# Altium project scc1002.PrjPCB
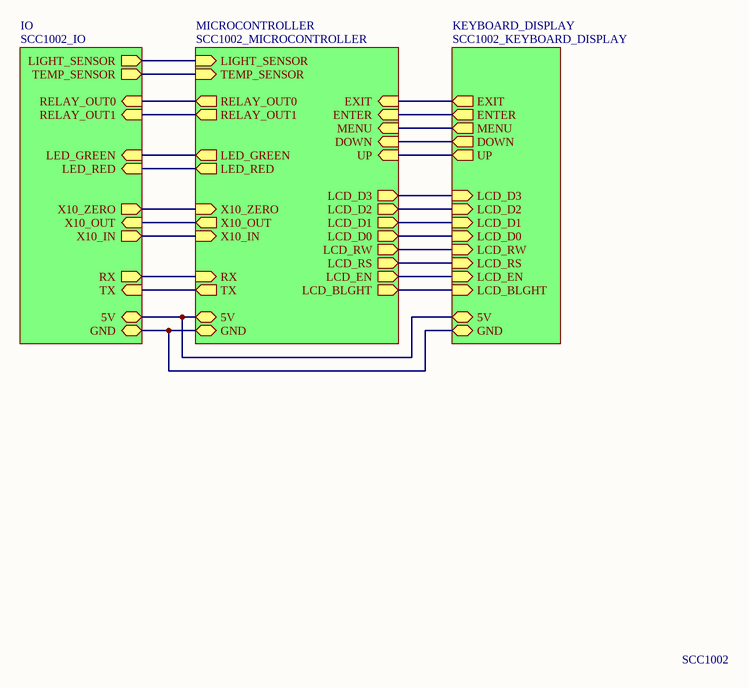
[diagram p0: scc1002_main.SchDoc]
4 sheets, 52 parts. Net scope: hierarchical (ports join the sheet entries above them; power ports are global).
Sheets:
  scc1002_main.SchDoc
    MICROCONTROLLER = SCC1002_MICROCONTROLLER.SchDoc
    KEYBOARD_DISPLAY = SCC1002_KEYBOARD_DISPLAY.SchDoc
    IO = SCC1002_IO.SchDoc

## Sheet scc1002_main.SchDoc
size A4; DrawnBy: Marco

### Sub-sheets
IO = SCC1002_IO: LIGHT_SENSOR (out), TEMP_SENSOR (out), RELAY_OUT0 (in), RELAY_OUT1 (in), LED_GREEN (in), LED_RED (in), X10_ZERO (out), X10_OUT (in), X10_IN (out), RX (out), TX (in), GND, 5V
KEYBOARD_DISPLAY = SCC1002_KEYBOARD_DISPLAY: EXIT (out), ENTER (out), MENU (out), DOWN (out), UP (out), LCD_D3 (in), LCD_D2 (in), LCD_D1 (in), LCD_D0 (in), LCD_RW (in), LCD_RS (in), LCD_EN (in), GND, 5V, LCD_BLGHT (in)
MICROCONTROLLER = SCC1002_MICROCONTROLLER: EXIT (in), ENTER (in), MENU (in), DOWN (in), UP (in), LCD_D3 (out), LCD_D2 (out), LCD_D1 (out), LCD_D0 (out), LCD_RW (out), LCD_RS (out), LCD_EN (out), LIGHT_SENSOR (in), TEMP_SENSOR (in), RELAY_OUT0 (out), RELAY_OUT1 (out), LED_GREEN (out), LED_RED (out), X10_ZERO (in), X10_OUT (out), X10_IN (in), RX (in), TX (out), GND, 5V, LCD_BLGHT (out)

### Nets
GND: sheet MICROCONTROLLER/GND, sheet KEYBOARD_DISPLAY/GND, sheet IO/GND
VCC: sheet MICROCONTROLLER/5V, sheet KEYBOARD_DISPLAY/5V, sheet IO/5V
NetC?#4_1: sheet MICROCONTROLLER/UP, sheet KEYBOARD_DISPLAY/UP
NetC?#5_1: sheet MICROCONTROLLER/MENU, sheet KEYBOARD_DISPLAY/MENU
NetC?#6_1: sheet MICROCONTROLLER/ENTER, sheet KEYBOARD_DISPLAY/ENTER
NetC?#7_1: sheet MICROCONTROLLER/EXIT, sheet KEYBOARD_DISPLAY/EXIT
NetC?#8_1: sheet MICROCONTROLLER/DOWN, sheet KEYBOARD_DISPLAY/DOWN
NetLDR_1: sheet MICROCONTROLLER/LIGHT_SENSOR, sheet IO/LIGHT_SENSOR
NetP?#1_4: sheet MICROCONTROLLER/LCD_RS, sheet KEYBOARD_DISPLAY/LCD_RS
NetP?#1_5: sheet MICROCONTROLLER/LCD_RW, sheet KEYBOARD_DISPLAY/LCD_RW
NetP?#1_6: sheet MICROCONTROLLER/LCD_EN, sheet KEYBOARD_DISPLAY/LCD_EN
NetP?#1_11: sheet MICROCONTROLLER/LCD_D0, sheet KEYBOARD_DISPLAY/LCD_D0
NetP?#1_12: sheet MICROCONTROLLER/LCD_D1, sheet KEYBOARD_DISPLAY/LCD_D1
NetP?#1_13: sheet MICROCONTROLLER/LCD_D2, sheet KEYBOARD_DISPLAY/LCD_D2
NetP?#1_14: sheet MICROCONTROLLER/LCD_D3, sheet KEYBOARD_DISPLAY/LCD_D3
NetP?#1_15: sheet MICROCONTROLLER/LCD_BLGHT, sheet KEYBOARD_DISPLAY/LCD_BLGHT
NetP?#4_1: sheet MICROCONTROLLER/X10_ZERO, sheet IO/X10_ZERO
NetP?#4_3: sheet MICROCONTROLLER/X10_IN, sheet IO/X10_IN
NetR?#8_1: sheet MICROCONTROLLER/TEMP_SENSOR, sheet IO/TEMP_SENSOR
NetR?#10_2: sheet MICROCONTROLLER/RELAY_OUT1, sheet IO/RELAY_OUT1
NetR?#11_2: sheet MICROCONTROLLER/LED_GREEN, sheet IO/LED_GREEN
NetR?#12_2: sheet MICROCONTROLLER/LED_RED, sheet IO/LED_RED
NetR?#15_2: sheet MICROCONTROLLER/X10_OUT, sheet IO/X10_OUT
NetU?#1_6: sheet MICROCONTROLLER/RELAY_OUT0, sheet IO/RELAY_OUT0
NetU?#1_25: sheet MICROCONTROLLER/TX, sheet IO/TX
NetU?#1_26: sheet MICROCONTROLLER/RX, sheet IO/RX

### Notes on the sheet
- SCC1002

## Sheet SCC1002_MICROCONTROLLER.SchDoc
size A4; DrawnBy: Marco; Organization: HomeAuto; ProjectName: SCC1002
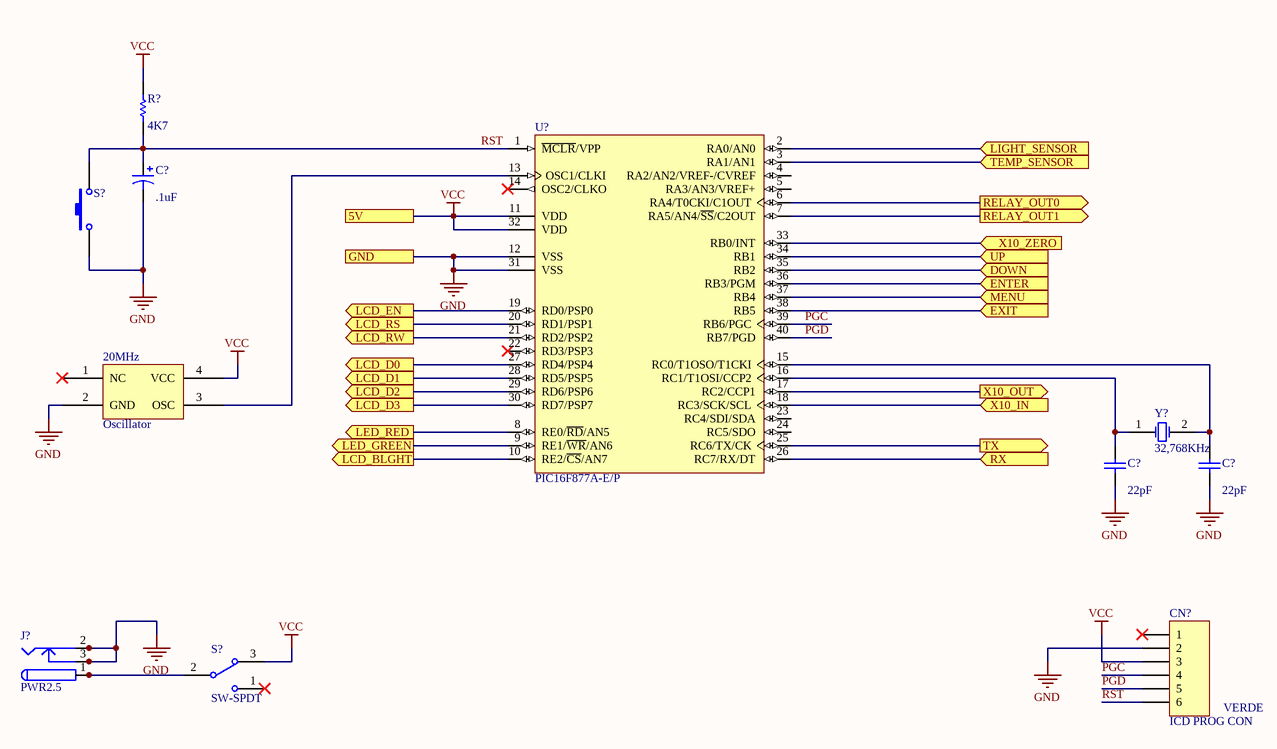
[diagram p1: SCC1002_MICROCONTROLLER.SchDoc]

### Parts
(Parts that share a designator on the sheet are numbered #1, #2 ... from top to bottom, then left to right.)
20MHz  Oscillator
C?#1  value .1uF  [RB7.6-15]  (hidden comment: Cap Pol1)
C?#2  value 22pF  [RAD-0.3]  (hidden comment: Cap)
C?#3  value 22pF  [RAD-0.3]  (hidden comment: Cap)
CN?  ICD PROG CON  [HDR1X6]
J?#1  PWR2.5  [KLD-0202]
R?#1  value 4K7  [AXIAL-0.3]  (hidden comment: Res1)
S?#1  SW-PB  [SPST-2]  (value not drawn)
S?#2  SW-SPDT  [TL36WW15050]
U?#1  PIC16F877A-E/P  [PDIP600-P40]
Y?  32,768KHz  [R38]

### Ports
5V, DOWN (in), ENTER (in), EXIT (in), GND, LCD_BLGHT (out), LCD_D0 (out), LCD_D1 (out), LCD_D2 (out), LCD_D3 (out), LCD_EN (out), LCD_RS (out), LCD_RW (out), LED_GREEN (out), LED_RED (out), LIGHT_SENSOR (in), MENU (in), RELAY_OUT0 (out), RELAY_OUT1 (out), RX (in), TEMP_SENSOR (in), TX (out), UP (in), X10_IN (in), X10_OUT (out), X10_ZERO (in)

### Nets
GND: 20MHz.2(GND) C?#1.2 C?#2.1 C?#3.1 CN?.2 J?#1.2 J?#1.2A J?#1.2B J?#1.3 J?#1.3A J?#1.3B S?#1.1 U?#1.12(VSS) U?#1.31(VSS) ; port GND
VCC: 20MHz.4(VCC) CN?.3 R?#1.2 S?#2.3 U?#1.11(VDD) U?#1.32(VDD) ; port 5V
PGC: CN?.4 U?#1.39(RB6/PGC)
PGD: CN?.5 U?#1.40(RB7/PGD)
RST: C?#1.1 CN?.6 R?#1.1 S?#1.2 U?#1.1(~{MCLR}/VPP)
Net20MHz_3: 20MHz.3(OSC) U?#1.13(OSC1/CLKI)
NetC?#2_2: C?#2.2 U?#1.16(RC1/T1OSI/CCP2) Y?.1(OSC1)
NetC?#3_2: C?#3.2 U?#1.15(RC0/T1OSO/T1CKI) Y?.2(OSC2)
NetC?#4_1: U?#1.34(RB1) ; port UP
NetC?#5_1: U?#1.37(RB4) ; port MENU
NetC?#6_1: U?#1.36(RB3/PGM) ; port ENTER
NetC?#7_1: U?#1.38(RB5) ; port EXIT
NetC?#8_1: U?#1.35(RB2) ; port DOWN
NetJ?#1_1: J?#1.1 J?#1.1A J?#1.1B S?#2.2
NetLDR_1: U?#1.2(RA0/AN0) ; port LIGHT_SENSOR
NetP?#1_4: U?#1.20(RD1/PSP1) ; port LCD_RS
NetP?#1_5: U?#1.21(RD2/PSP2) ; port LCD_RW
NetP?#1_6: U?#1.19(RD0/PSP0) ; port LCD_EN
NetP?#1_11: U?#1.27(RD4/PSP4) ; port LCD_D0
NetP?#1_12: U?#1.28(RD5/PSP5) ; port LCD_D1
NetP?#1_13: U?#1.29(RD6/PSP6) ; port LCD_D2
NetP?#1_14: U?#1.30(RD7/PSP7) ; port LCD_D3
NetP?#1_15: U?#1.10(RE2/~{CS}/AN7) ; port LCD_BLGHT
NetP?#4_1: U?#1.33(RB0/INT) ; port X10_ZERO
NetP?#4_3: U?#1.18(RC3/SCK/SCL) ; port X10_IN
NetR?#8_1: U?#1.3(RA1/AN1) ; port TEMP_SENSOR
NetR?#10_2: U?#1.7(RA5/AN4/~{SS}/C2OUT) ; port RELAY_OUT1
NetR?#11_2: U?#1.9(RE1/~{WR}/AN6) ; port LED_GREEN
NetR?#12_2: U?#1.8(RE0/~{RD}/AN5) ; port LED_RED
NetR?#15_2: U?#1.17(RC2/CCP1) ; port X10_OUT
NetU?#1_6: U?#1.6(RA4/T0CKI/C1OUT) ; port RELAY_OUT0
NetU?#1_25: U?#1.25(RC6/TX/CK) ; port TX
NetU?#1_26: U?#1.26(RC7/RX/DT) ; port RX

Not connected (* = marked no-connect by the designer): 20MHz 1(NC)*; CN? 1*; S?#2 1*; U?#1 4(RA2/AN2/VREF-/CVREF) 5(RA3/AN3/VREF+) 14(OSC2/CLKO)* 22(RD3/PSP3)* 23(RC4/SDI/SDA) 24(RC5/SDO)

### Notes on the sheet
- VERDE

### Library data of the parts
20MHz = Oscilator: Integrated oscillator
C?#1 = Cap Pol1: Polarized Capacitor (Radial); Published: 8-Jun-2000; LatestRevisionDate: 17-Jul-2002; LatestRevisionNote: Re-released for DXP Platform.; PackageReference: RB7.6-15; Publisher: Altium Limited; PackageDescription: Polarized Capacitor (Radial); 2 Leads
C?#2 C?#3 = Cap: Capacitor; Published: 8-Jun-2000; LatestRevisionDate: 17-Jul-2002; LatestRevisionNote: Re-released for DXP Platform.; PackageReference: RAD-0.3; Publisher: Altium Limited; PackageDescription: Radial Cap, Thru-Hole; 2 Leads; 0.3 in Pin Spacing
CN? = Header 6: Header, 6-Pin; LatestRevisionDate: 17-Jul-2002; LatestRevisionNote: Re-released for DXP Platform.; Publisher: Altium Limited
J?#1 = PWR2.5: Low Voltage Power Supply Connector; Published: 17-Dec-2003; DatasheetDocument: 09-May-2002; Publisher: Altium Limited; ComponentLink1Description: Manufacturer Link; ComponentLink1URL: http://domino.kycon.com/internet/Products.html
R?#1 = Res1: Resistor; Published: 8-Jun-2000; LatestRevisionDate: 17-Jul-2002; LatestRevisionNote: Re-released for DXP Platform.; PackageReference: AXIAL-0.3; Publisher: Altium Limited; PackageDescription: Axial Device, Thru-Hole; 2 Leads; 0.3 in Pin Spacing
S?#1 = SW-PB: Switch; Published: 24-Mar-1999; LatestRevisionDate: 17-Jul-2002; LatestRevisionNote: Re-released for DXP Platform.; PackageReference: SPST-2; Publisher: Altium Limited; PackageDescription: Switch; 2 Leads
S?#2 = SW-SPDT: SPDT Subminiature Toggle Switch, Right Angle Mounting, Vertical Actuation; Published: 24-Mar-1999; LatestRevisionDate: 17-Dec-2003; LatestRevisionNote: Schematic revised, PCB Footprint replaced.; DatasheetVersion: 05-Dec-2000; PackageReference: TL36WW15050; Publisher: Altium Limited; PackageDescription: Switch; 4 Leads; ComponentLink1Description: Manufacturer Link; ComponentLink1URL: http://www.apem.com
U?#1 = PIC16F877A-E/P: Enhanced FLASH Microcontroller, 8K (x14-Bit words) FLASH, 368 Bytes RAM, 40-Pin PDIP, Standard VDD Range, Extended Temperature; ComponentAvailability: Unknown. Contact manufacturer to determine status.; Published: 11-Oct-2004; LatestRevisionDate: 29-Jan-2009; LatestRevisionNote: Sch. layout revised. 3D Model Removed.; DatasheetVersion: revB, Oct-2003; PackageVersion: revBB, Aug-2009; PackageReference: PDIP600-P40; Publisher: Altium Limited; PackageDescription: 40-Lead Plastic Dual In-Line (P) - 600 mil Body [PDIP]; Supplier 1: Digi-Key; Supplier Part Number 1: PIC16F877A-E/P-ND; Supplier 2: Farnell; Supplier Part Number 2: 1567990; ComponentLink1Description: Datasheet; ComponentLink1URL: http://ww1.microchip.com/downloads/en/DeviceDoc/39582b.pdf; ComponentLink2Description: Packaging Specification; ComponentLink2URL: http://www.microchip.com/stellent/groups/techpub_sg/documents/packagingspec/en012702.pdf; ComponentLink3Description: Microchip.com Home; ComponentLink3URL: http://www.microchip.com/
Y? = XTAL: Crystal Oscillator; Published: 8-Jun-2000; LatestRevisionDate: 17-Jul-2002; LatestRevisionNote: Re-released for DXP Platform.; PackageReference: R38; Publisher: Altium Limited; PackageDescription: Crystal, Thru-Hole; 2 Leads; Body 3.1 x 8.2 mm (Dia.xH)

## Sheet SCC1002_KEYBOARD_DISPLAY.SchDoc
size A4; DrawnBy: Marco
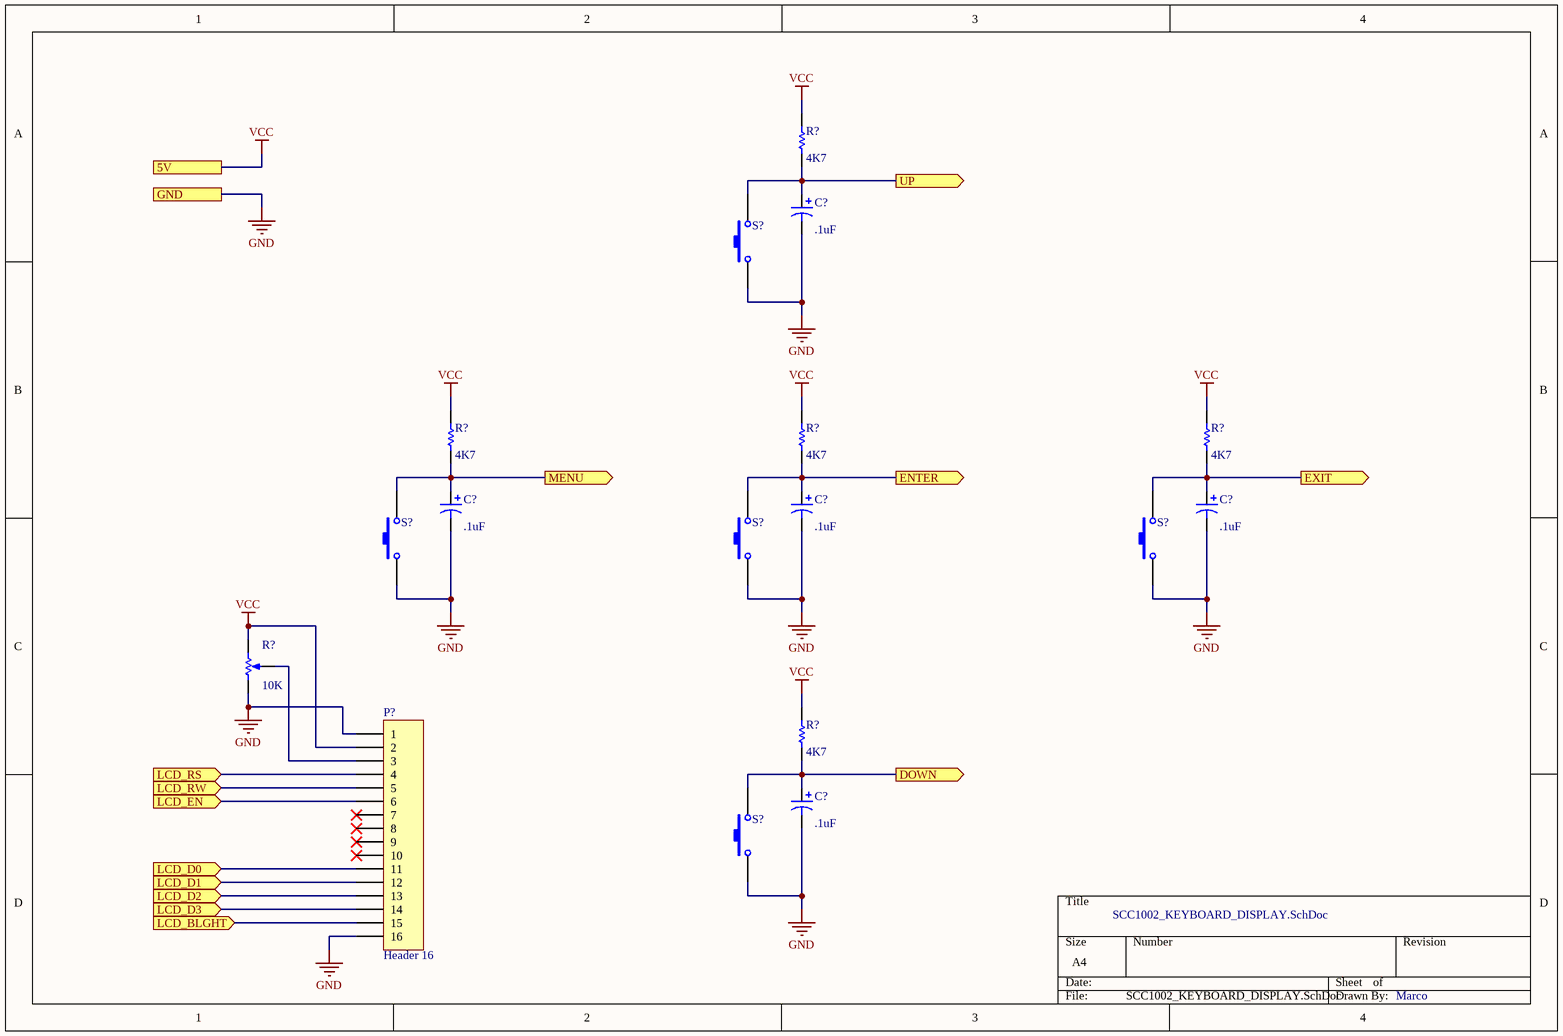
[diagram p2: SCC1002_KEYBOARD_DISPLAY.SchDoc]

### Parts
(Parts that share a designator on the sheet are numbered #1, #2 ... from top to bottom, then left to right.)
C?#4  value .1uF  [RB7.6-15]  (hidden comment: Cap Pol1)
C?#5  value .1uF  [RB7.6-15]  (hidden comment: Cap Pol1)
C?#6  value .1uF  [RB7.6-15]  (hidden comment: Cap Pol1)
C?#7  value .1uF  [RB7.6-15]  (hidden comment: Cap Pol1)
C?#8  value .1uF  [RB7.6-15]  (hidden comment: Cap Pol1)
P?#1  Header 16  [HDR1X16]
R?#2  value 4K7  [AXIAL-0.3]  (hidden comment: Res1)
R?#3  value 4K7  [AXIAL-0.3]  (hidden comment: Res1)
R?#4  value 4K7  [AXIAL-0.3]  (hidden comment: Res1)
R?#5  value 4K7  [AXIAL-0.3]  (hidden comment: Res1)
R?#6  value 10K  [VR5]  (hidden comment: RPot)
R?#7  value 4K7  [AXIAL-0.3]  (hidden comment: Res1)
S?#3  SW-PB  [SPST-2]  (value not drawn)
S?#4  SW-PB  [SPST-2]  (value not drawn)
S?#5  SW-PB  [SPST-2]  (value not drawn)
S?#6  SW-PB  [SPST-2]  (value not drawn)
S?#7  SW-PB  [SPST-2]  (value not drawn)

### Ports
5V, DOWN (out), ENTER (out), EXIT (out), GND, LCD_BLGHT (in), LCD_D0 (in), LCD_D1 (in), LCD_D2 (in), LCD_D3 (in), LCD_EN (in), LCD_RS (in), LCD_RW (in), MENU (out), UP (out)

### Nets
GND: C?#4.2 C?#5.2 C?#6.2 C?#7.2 C?#8.2 P?#1.1 P?#1.16 R?#6.1(TOP) S?#3.1 S?#4.1 S?#5.1 S?#6.1 S?#7.1 ; port GND
VCC: P?#1.2 R?#2.2 R?#3.2 R?#4.2 R?#5.2 R?#6.2(BOT) R?#7.2 ; port 5V
NetC?#4_1: C?#4.1 R?#2.1 S?#3.2 ; port UP
NetC?#5_1: C?#5.1 R?#3.1 S?#4.2 ; port MENU
NetC?#6_1: C?#6.1 R?#4.1 S?#5.2 ; port ENTER
NetC?#7_1: C?#7.1 R?#5.1 S?#6.2 ; port EXIT
NetC?#8_1: C?#8.1 R?#7.1 S?#7.2 ; port DOWN
NetP?#1_3: P?#1.3 R?#6.3(TAP)
NetP?#1_4: P?#1.4 ; port LCD_RS
NetP?#1_5: P?#1.5 ; port LCD_RW
NetP?#1_6: P?#1.6 ; port LCD_EN
NetP?#1_11: P?#1.11 ; port LCD_D0
NetP?#1_12: P?#1.12 ; port LCD_D1
NetP?#1_13: P?#1.13 ; port LCD_D2
NetP?#1_14: P?#1.14 ; port LCD_D3
NetP?#1_15: P?#1.15 ; port LCD_BLGHT

Not connected (* = marked no-connect by the designer): P?#1 7* 8* 9* 10*

### Library data of the parts
C?#4-C?#8 = Cap Pol1: Polarized Capacitor (Radial); Published: 8-Jun-2000; LatestRevisionDate: 17-Jul-2002; LatestRevisionNote: Re-released for DXP Platform.; PackageReference: RB7.6-15; Publisher: Altium Limited; PackageDescription: Polarized Capacitor (Radial); 2 Leads
P?#1 = Header 16: Header, 16-Pin; LatestRevisionDate: 17-Jul-2002; LatestRevisionNote: Re-released for DXP Platform.; Publisher: Altium Limited
R?#2-R?#5 R?#7 = Res1: Resistor; Published: 8-Jun-2000; LatestRevisionDate: 17-Jul-2002; LatestRevisionNote: Re-released for DXP Platform.; PackageReference: AXIAL-0.3; Publisher: Altium Limited; PackageDescription: Axial Device, Thru-Hole; 2 Leads; 0.3 in Pin Spacing
R?#6 = RPot: Potentiometer; Sim Note: Enter the Resistance value and the set point into parameter fields.; Set Position: 0.5; Published: 8-Jun-2000; LatestRevisionDate: 17-Jul-2002; LatestRevisionNote: Re-released for DXP Platform.; PackageReference: VR5; Publisher: Altium Limited; PackageDescription: Variable Resistor, Thru-Hole; 3 Leads
S?#3-S?#7 = SW-PB: Switch; Published: 24-Mar-1999; LatestRevisionDate: 17-Jul-2002; LatestRevisionNote: Re-released for DXP Platform.; PackageReference: SPST-2; Publisher: Altium Limited; PackageDescription: Switch; 2 Leads

## Sheet SCC1002_IO.SchDoc
size A4; DrawnBy: Marco
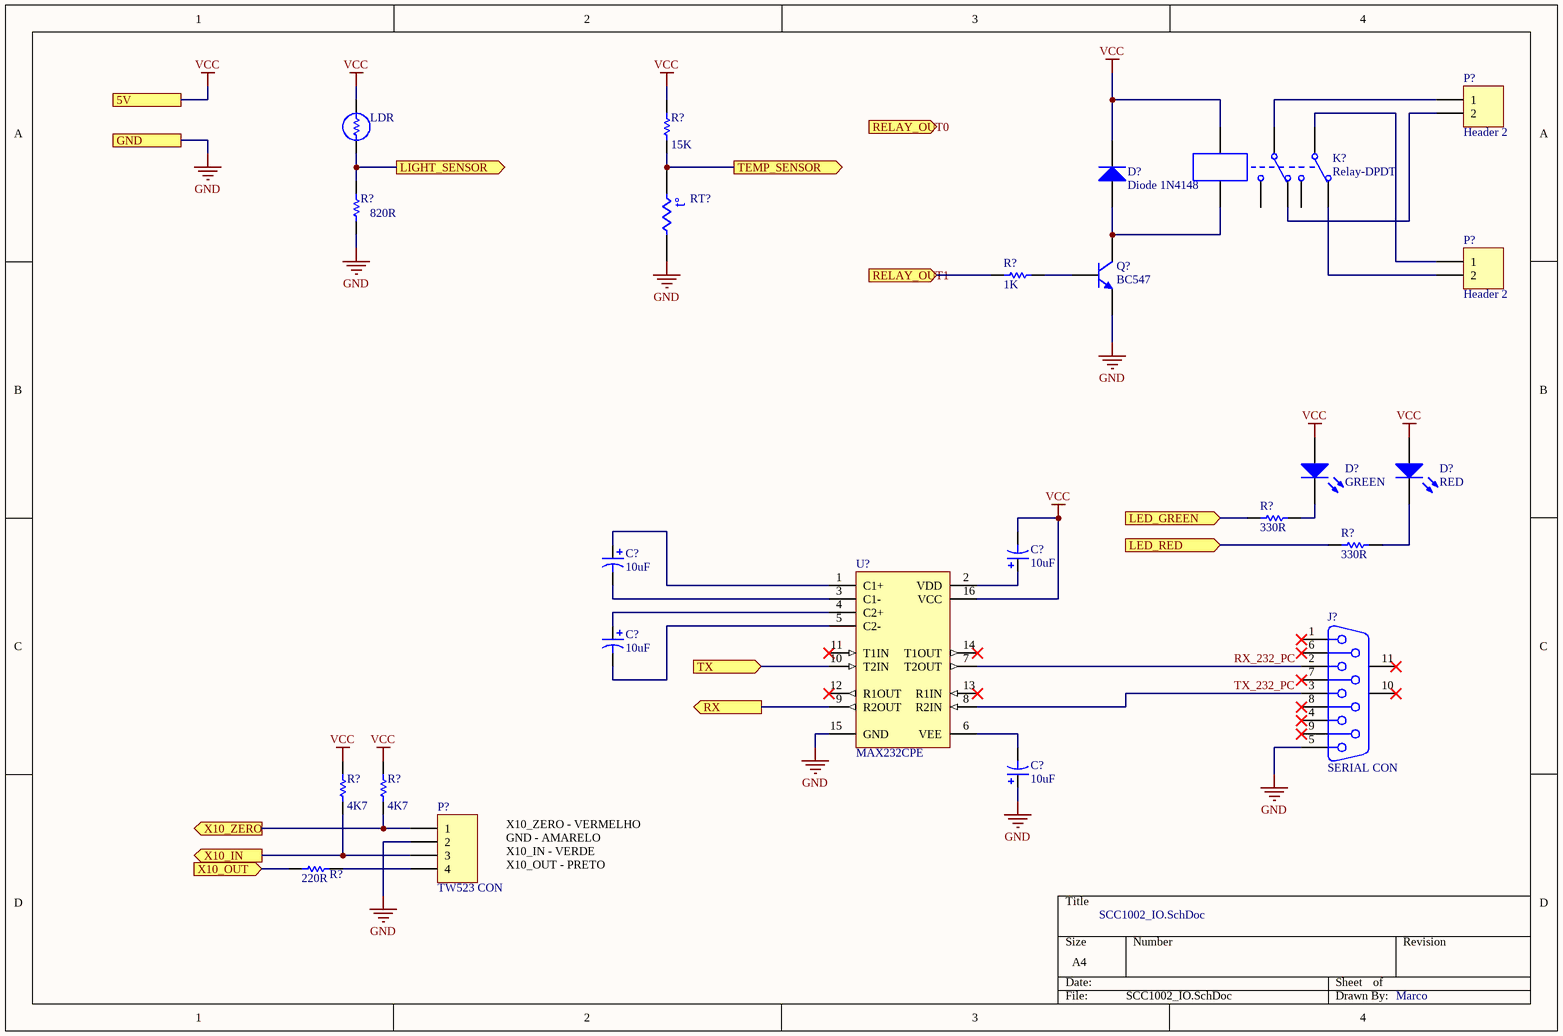
[diagram p3: SCC1002_IO.SchDoc]

### Parts
(Parts that share a designator on the sheet are numbered #1, #2 ... from top to bottom, then left to right.)
C?#9  value 10uF  [RB7.6-15]  (hidden comment: Cap Pol1)
C?#10  value 10uF  [RB7.6-15]  (hidden comment: Cap Pol1)
C?#11  value 10uF  [RB7.6-15]  (hidden comment: Cap Pol1)
C?#12  value 10uF  [RB7.6-15]  (hidden comment: Cap Pol1)
D?#1  Diode 1N4148  [DO-35]
D?#2  GREEN  [3.2X1.6X1.1]
D?#3  RED  [3.2X1.6X1.1]
J?#2  SERIAL CON  [DSUB1.385-2H9]
K?  Relay-DPDT  [DIP-P8]
LDR  LDR  (value not drawn)
P?#2  Header 2  [HDR1X2]
P?#3  Header 2  [HDR1X2]
P?#4  TW523 CON  [HDR1X4]
Q?  BC547  [TO-92A]
R?#8  value 15K  [AXIAL-0.3]  (hidden comment: Res1)
R?#9  value 820R  [AXIAL-0.3]  (hidden comment: Res1)
R?#10  value 1K  [AXIAL-0.3]  (hidden comment: Res1)
R?#11  value 330R  [AXIAL-0.3]  (hidden comment: Res1)
R?#12  value 330R  [AXIAL-0.3]  (hidden comment: Res1)
R?#13  value 4K7  [AXIAL-0.3]  (hidden comment: Res1)
R?#14  value 4K7  [AXIAL-0.3]  (hidden comment: Res1)
R?#15  value 220R  [AXIAL-0.3]  (hidden comment: Res1)
RT?  Res Thermal  [6-0805_N]  (value not drawn)
U?#2  MAX232CPE  [PE16A]

### Ports
5V, GND, LED_GREEN (in), LED_RED (in), LIGHT_SENSOR (out), RELAY_OUT0 (in), RELAY_OUT1 (in), RX (out), TEMP_SENSOR (out), TX (in), X10_IN (out), X10_OUT (in), X10_ZERO (out)

### Nets
GND: C?#12.1 J?#2.5 P?#4.2 Q?.1(E) R?#9.1 RT?.2 U?#2.15(GND) ; port GND
VCC: C?#10.2 D?#1.2(K) D?#2.1(A) D?#3.1(A) K?.7 LDR.2 R?#8.2 R?#13.2 R?#14.2 U?#2.16(VCC) ; port 5V
RX_232_PC: J?#2.2 U?#2.7(T2OUT)
TX_232_PC: J?#2.3 U?#2.8(R2IN)
NetC?#9_1: C?#9.1 U?#2.1(C1+)
NetC?#9_2: C?#9.2 U?#2.3(C1-)
NetC?#10_1: C?#10.1 U?#2.2(VDD)
NetC?#11_1: C?#11.1 U?#2.4(C2+)
NetC?#11_2: C?#11.2 U?#2.5(C2-)
NetC?#12_2: C?#12.2 U?#2.6(VEE)
NetD?#1_1: D?#1.1(A) K?.8 Q?.3(C)
NetD?#2_2: D?#2.2(K) R?#11.1
NetD?#3_2: D?#3.2(K) R?#12.1
NetK?_1: K?.1 P?#3.1
NetK?_2: K?.2 P?#3.2
NetK?_4: K?.4 P?#2.1
NetK?_5: K?.5 P?#2.2
NetLDR_1: LDR.1 R?#9.2 ; port LIGHT_SENSOR
NetP?#4_1: P?#4.1 R?#14.1 ; port X10_ZERO
NetP?#4_3: P?#4.3 R?#13.1 ; port X10_IN
NetP?#4_4: P?#4.4 R?#15.1
NetQ?_2: Q?.2(B) R?#10.1
NetR?#8_1: R?#8.1 RT?.1 ; port TEMP_SENSOR
NetR?#10_2: R?#10.2 ; port RELAY_OUT1
NetR?#11_2: R?#11.2 ; port LED_GREEN
NetR?#12_2: R?#12.2 ; port LED_RED
NetR?#15_2: R?#15.2 ; port X10_OUT
NetU?#1_25: U?#2.10(T2IN) ; port TX
NetU?#1_26: U?#2.9(R2OUT) ; port RX

Not connected (* = marked no-connect by the designer): J?#2 1* 4* 6* 7* 8* 9* 10(MH1)* 11(MH2)*; K? 3 6; U?#2 11(T1IN)* 12(R1OUT)* 13(R1IN)* 14(T1OUT)*

### Notes on the sheet
- X10_ZERO - VERMELHO
  GND - AMARELO
  X10_IN - VERDE
  X10_OUT - PRETO
- (in symbol Res Thermal) t°

### Library data of the parts
C?#9-C?#12 = Cap Pol1: Polarized Capacitor (Radial); Published: 8-Jun-2000; LatestRevisionDate: 17-Jul-2002; LatestRevisionNote: Re-released for DXP Platform.; PackageReference: RB7.6-15; Publisher: Altium Limited; PackageDescription: Polarized Capacitor (Radial); 2 Leads
D?#1 = Diode 1N4148: High Conductance Fast Diode; Published: 8-Jun-2000; LatestRevisionDate: 17-Jul-2002; LatestRevisionNote: Re-released for DXP Platform.; DatasheetVersion: 1997; PackageReference: DO-35; Publisher: Altium Limited; PackageDescription: Diode, Axial; Body 3.8 x 1.9 mm (LxDia. max), Lead Dia. 0.53 mm (max); Code_JEDEC: DO-204-AH; ComponentLink1Description: Manufacturer Link; ComponentLink1URL: http://www.fairchildsemi.com/; ComponentLink2Description: Datasheet; ComponentLink2URL: http://www.fairchildsemi.com/ds/1N%2F1N4148.pdf
D?#2 D?#3 = LED2: Typical RED, GREEN, YELLOW, AMBER GaAs LED; Published: 8-Jun-2000; LatestRevisionDate: 17-Jul-2002; LatestRevisionNote: Re-released for DXP Platform.; PackageVersion: Feb-2002; PackageReference: 3.2X1.6X1.1; Publisher: Altium Limited; PackageDescription: SM LED; 2 Flat Leads
J?#2 = D Connector 9: Receptacle Assembly, 9 Position, Right Angle; PackageDocument: O; Positions: 9; Published: 15-Jun-2001; LatestRevisionDate: 17-Jul-2002; LatestRevisionNote: Re-released for DXP Platform.; DatasheetDocument: 1-Sep-1999; PackageReference: 788750; Publisher: Altium Limited; Orientation: Right Angle; Gender: Receptacle
K? = Relay-DPDT: Dual-Pole Dual-Throw Relay; Published: 24-Mar-1999; LatestRevisionDate: 17-Jul-2002; LatestRevisionNote: Re-released for DXP Platform.; PackageReference: DIP-P8; Publisher: Altium Limited; PackageDescription: Relay; 8 Leads
LDR = LDR: Light Dependent Resistor
P?#2 P?#3 = Header 2: Header, 2-Pin; LatestRevisionDate: 17-Jul-2002; LatestRevisionNote: Re-released for DXP Platform.; Publisher: Altium Limited
P?#4 = Header 4: Header, 4-Pin; LatestRevisionDate: 17-Jul-2002; LatestRevisionNote: Re-released for DXP Platform.; Publisher: Altium Limited
Q? = 2N3904: NPN General Purpose Amplifier; Published: 8-Jun-2000; LatestRevisionDate: 15-Jan-2003; LatestRevisionNote: PCB Footprint 'BCY-W3/D4.7' replaced; DatasheetVersion: 1997; PackageVersion: Sep-1998; PackageReference: TO-92A; Publisher: Altium Limited; PackageDescription: TO, Flat Index; 3 In-Line, Axial Leads; Body Dia. 4.5mm; Leads 0.51 x 0.48 mm (max); ComponentLink1Description: Manufacturer Link; ComponentLink1URL: http://www.fairchildsemi.com/; ComponentLink2Description: Datasheet; ComponentLink2URL: http://www.fairchildsemi.com/ds/2N%2F2N3904.pdf
R?#8-R?#15 = Res1: Resistor; Published: 8-Jun-2000; LatestRevisionDate: 17-Jul-2002; LatestRevisionNote: Re-released for DXP Platform.; PackageReference: AXIAL-0.3; Publisher: Altium Limited; PackageDescription: Axial Device, Thru-Hole; 2 Leads; 0.3 in Pin Spacing
RT? = Res Thermal: Thermistor; Published: 24-Mar-1999; LatestRevisionDate: 29-May-2009; LatestRevisionNote: IPC-7351 Footprint Added.; PackageVersion: Mar-2003; PackageReference: 6-0805; Publisher: Altium Limited; PackageDescription: Chip Resistor 0805 Case Size; Code_IPC: RESC2012
U?#2 = MAX232CPE: +5V Powered RS-232 Driver/Receiver; Published: 16-Jan-2001; LatestRevisionDate: 29-May-2009; LatestRevisionNote: Component Body Added.; DatasheetVersion: Apr-1992; PackageVersion: 1997; PackageReference: PE16A; Publisher: Altium Limited; PackageDescription: DIP, 16-Pin, Row Spacing 7.62 mm, Pitch 2.54 mm; Code_JEDEC: MS-001-BB; ComponentLink1Description: Manufacturer Link; ComponentLink1URL: http://www.maxim-ic.com/; ComponentLink2Description: Datasheet; ComponentLink2URL: http://pdfserv.maxim-ic.com/en/ds/MAX220-MAX249.pdf

## Nets that join several sheets
GND: SCC1002_MICROCONTROLLER (14 pins), SCC1002_KEYBOARD_DISPLAY (13 pins), SCC1002_IO (7 pins)
VCC: SCC1002_MICROCONTROLLER (6 pins), SCC1002_KEYBOARD_DISPLAY (7 pins), SCC1002_IO (10 pins)
NetC?#4_1: SCC1002_MICROCONTROLLER (U?#1.34), SCC1002_KEYBOARD_DISPLAY (C?#4.1 R?#2.1 S?#3.2)
NetC?#5_1: SCC1002_MICROCONTROLLER (U?#1.37), SCC1002_KEYBOARD_DISPLAY (C?#5.1 R?#3.1 S?#4.2)
NetC?#6_1: SCC1002_MICROCONTROLLER (U?#1.36), SCC1002_KEYBOARD_DISPLAY (C?#6.1 R?#4.1 S?#5.2)
NetC?#7_1: SCC1002_MICROCONTROLLER (U?#1.38), SCC1002_KEYBOARD_DISPLAY (C?#7.1 R?#5.1 S?#6.2)
NetC?#8_1: SCC1002_MICROCONTROLLER (U?#1.35), SCC1002_KEYBOARD_DISPLAY (C?#8.1 R?#7.1 S?#7.2)
NetLDR_1: SCC1002_MICROCONTROLLER (U?#1.2), SCC1002_IO (LDR.1 R?#9.2)
NetP?#1_4: SCC1002_MICROCONTROLLER (U?#1.20), SCC1002_KEYBOARD_DISPLAY (P?#1.4)
NetP?#1_5: SCC1002_MICROCONTROLLER (U?#1.21), SCC1002_KEYBOARD_DISPLAY (P?#1.5)
NetP?#1_6: SCC1002_MICROCONTROLLER (U?#1.19), SCC1002_KEYBOARD_DISPLAY (P?#1.6)
NetP?#1_11: SCC1002_MICROCONTROLLER (U?#1.27), SCC1002_KEYBOARD_DISPLAY (P?#1.11)
NetP?#1_12: SCC1002_MICROCONTROLLER (U?#1.28), SCC1002_KEYBOARD_DISPLAY (P?#1.12)
NetP?#1_13: SCC1002_MICROCONTROLLER (U?#1.29), SCC1002_KEYBOARD_DISPLAY (P?#1.13)
NetP?#1_14: SCC1002_MICROCONTROLLER (U?#1.30), SCC1002_KEYBOARD_DISPLAY (P?#1.14)
NetP?#1_15: SCC1002_MICROCONTROLLER (U?#1.10), SCC1002_KEYBOARD_DISPLAY (P?#1.15)
NetP?#4_1: SCC1002_MICROCONTROLLER (U?#1.33), SCC1002_IO (P?#4.1 R?#14.1)
NetP?#4_3: SCC1002_MICROCONTROLLER (U?#1.18), SCC1002_IO (P?#4.3 R?#13.1)
NetR?#8_1: SCC1002_MICROCONTROLLER (U?#1.3), SCC1002_IO (R?#8.1 RT?.1)
NetR?#10_2: SCC1002_MICROCONTROLLER (U?#1.7), SCC1002_IO (R?#10.2)
NetR?#11_2: SCC1002_MICROCONTROLLER (U?#1.9), SCC1002_IO (R?#11.2)
NetR?#12_2: SCC1002_MICROCONTROLLER (U?#1.8), SCC1002_IO (R?#12.2)
NetR?#15_2: SCC1002_MICROCONTROLLER (U?#1.17), SCC1002_IO (R?#15.2)
NetU?#1_25: SCC1002_MICROCONTROLLER (U?#1.25), SCC1002_IO (U?#2.10)
NetU?#1_26: SCC1002_MICROCONTROLLER (U?#1.26), SCC1002_IO (U?#2.9)